# Altium schematic sheet 05_Seven_Seg.SchDoc: ECE315 Analog
size A; Date: 4/25/2017; ApprovedBy: JSK; CheckedBy: JSK; Author: JSK; CompanyName: University of Wisconsin; DrawnBy: JSK; Engineer: JSK; Organization: ECE 315; Address1: College of Engineering; Address2: 1415 Engineering Drive; Address3: Madison, WI 53706; Address4: ECE 315 Fall 2017; Revision: A; SheetNumber: 2; SheetTotal: 2; AssemblyNumber: ECE315-F19; ApprovedDate: 04/02/2019
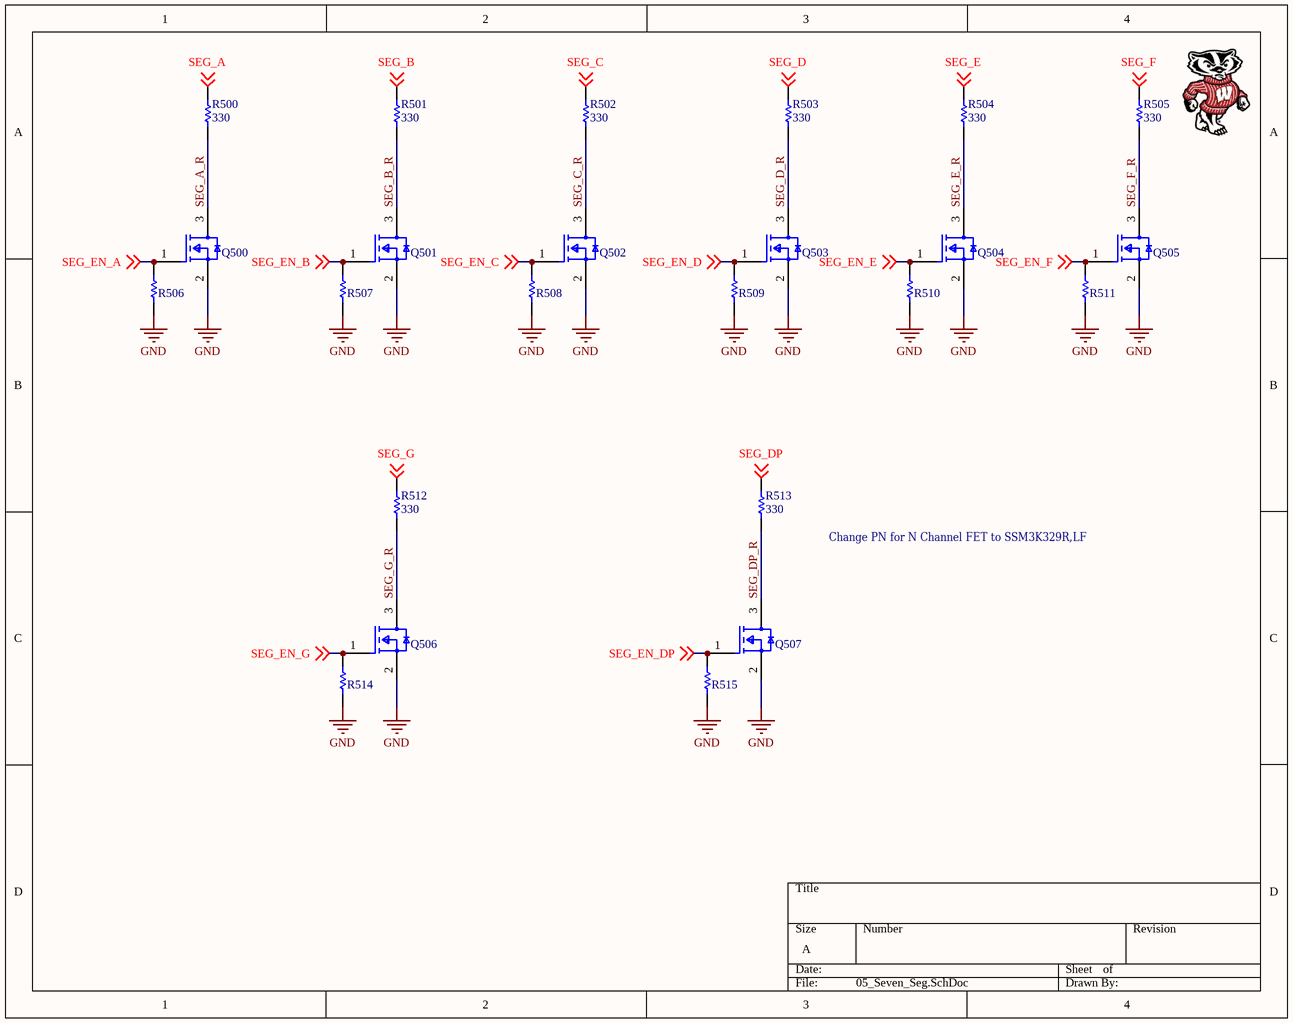
[diagram p0: 05_Seven_Seg.SchDoc]

## Parts
Q500  NDS7002A  [Diodes_Inc_SOT23_IPC_A]  (value not drawn)
Q501  NDS7002A  [Diodes_Inc_SOT23_IPC_A]  (value not drawn)
Q502  NDS7002A  [Diodes_Inc_SOT23_IPC_A]  (value not drawn)
Q503  NDS7002A  [Diodes_Inc_SOT23_IPC_A]  (value not drawn)
Q504  NDS7002A  [Diodes_Inc_SOT23_IPC_A]  (value not drawn)
Q505  NDS7002A  [Diodes_Inc_SOT23_IPC_A]  (value not drawn)
Q506  NDS7002A  [Diodes_Inc_SOT23_IPC_A]  (value not drawn)
Q507  NDS7002A  [Diodes_Inc_SOT23_IPC_A]  (value not drawn)
R500  330  [RES_0805]
R501  330  [RES_0805]
R502  330  [RES_0805]
R503  330  [RES_0805]
R504  330  [RES_0805]
R505  330  [RES_0805]
R506  RES_0805_K_010.00  [RES_0805]  (value not drawn)
R507  RES_0805_K_010.00  [RES_0805]  (value not drawn)
R508  RES_0805_K_010.00  [RES_0805]  (value not drawn)
R509  RES_0805_K_010.00  [RES_0805]  (value not drawn)
R510  RES_0805_K_010.00  [RES_0805]  (value not drawn)
R511  RES_0805_K_010.00  [RES_0805]  (value not drawn)
R512  330  [RES_0805]
R513  330  [RES_0805]
R514  RES_0805_K_010.00  [RES_0805]  (value not drawn)
R515  RES_0805_K_010.00  [RES_0805]  (value not drawn)

## Nets
GND: Q500.2(S) Q501.2(S) Q502.2(S) Q503.2(S) Q504.2(S) Q505.2(S) Q506.2(S) Q507.2(S) R506.1 R507.1 R508.1 R509.1 R510.1 R511.1 R514.1 R515.1
SEG_A: R500.2 ; off-sheet SEG_A
SEG_A_R: Q500.3(D) R500.1
SEG_B: R501.2 ; off-sheet SEG_B
SEG_B_R: Q501.3(D) R501.1
SEG_C: R502.2 ; off-sheet SEG_C
SEG_C_R: Q502.3(D) R502.1
SEG_D: R503.2 ; off-sheet SEG_D
SEG_D_R: Q503.3(D) R503.1
SEG_DP: R513.2 ; off-sheet SEG_DP
SEG_DP_R: Q507.3(D) R513.1
SEG_E: R504.2 ; off-sheet SEG_E
SEG_E_R: Q504.3(D) R504.1
SEG_EN_A: Q500.1(G) R506.2 ; off-sheet SEG_EN_A
SEG_EN_B: Q501.1(G) R507.2 ; off-sheet SEG_EN_B
SEG_EN_C: Q502.1(G) R508.2 ; off-sheet SEG_EN_C
SEG_EN_D: Q503.1(G) R509.2 ; off-sheet SEG_EN_D
SEG_EN_DP: Q507.1(G) R515.2 ; off-sheet SEG_EN_DP
SEG_EN_E: Q504.1(G) R510.2 ; off-sheet SEG_EN_E
SEG_EN_F: Q505.1(G) R511.2 ; off-sheet SEG_EN_F
SEG_EN_G: Q506.1(G) R514.2 ; off-sheet SEG_EN_G
SEG_F: R505.2 ; off-sheet SEG_F
SEG_F_R: Q505.3(D) R505.1
SEG_G: R512.2 ; off-sheet SEG_G
SEG_G_R: Q506.3(D) R512.1

## Notes on the sheet
- Change PN for N Channel FET to SSM3K329R,LF‎

## Library data of the parts
Q500-Q507 = NDS7002A: FAIRCHILD SEMICONDUCTOR         NDS7002A.            MOSFET, FULL REEL; Manufacturer 1: ON Semiconductor / Fairchild; Drain to Source Voltage (Vdss): 60V; Continuous Drain Current (ID): 280mA; Power Dissipation: 300mW; Drain to Source Resistance: 1.2R; Gate to Source Voltage (Vgs): 20V; Rds On Max: 2R; Input Capacitance: 50pF; Nominal Vgs: 2.1V; Number of Elements: 1; Element Configuration: Single; ComponentLink1URL: https://datasheet.ciiva.com/29746/dmn6140l-29746783.pdf?src-supplier=Digi-Key; ComponentLink1Description: https://datasheet.ciiva.com/29746/dmn6140l-29746783.pdf?src-supplier=Digi-Key; ComponentLink2URL: https://datasheet.ciiva.com/4444/ds30896-81375-4444887.pdf?src-supplier=Mouser; ComponentLink2Description: https://datasheet.ciiva.com/4444/ds30896-81375-4444887.pdf?src-supplier=Mouser; ComponentLink3URL: https://datasheet.ciiva.com/1254/ds30896-1254496.pdf?src-supplier=Newark; ComponentLink3Description: https://datasheet.ciiva.com/1254/ds30896-1254496.pdf?src-supplier=Newark; ComponentLink4URL: https://datasheet.ciiva.com/25624/0900766b81151e8c-25624936.pdf?src-supplier=RSComponents; ComponentLink4Description: https://datasheet.ciiva.com/25624/0900766b81151e8c-25624936.pdf?src-supplier=RSComponents; ComponentLink5URL: https://datasheet.ciiva.com/15137/getdatasheetpartid-75159-15137378.pdf?src-supplier=Verical; ComponentLink5Description: https://datasheet.ciiva.com/15137/getdatasheetpartid-75159-15137378.pdf?src-supplier=Verical; ComponentLink6URL: https://datasheet.ciiva.com/48532/ds30896-48532645.pdf?src-supplier=Avnet; ComponentLink6Description: https://datasheet.ciiva.com/48532/ds30896-48532645.pdf?src-supplier=Avnet; ComponentLink7URL: https://datasheet.ciiva.com/1188/ds30896-1188422.pdf?src-supplier=Element14; ComponentLink7Description: https://datasheet.ciiva.com/1188/ds30896-1188422.pdf?src-supplier=Element14; ComponentLink8URL: https://datasheet.ciiva.com/16200/ds30896-16200842.pdf?src-supplier=Future+Electronics; ComponentLink8Description: https://datasheet.ciiva.com/16200/ds30896-16200842.pdf?src-supplier=Future+Electronics; ComponentLink9URL: https://datasheet.ciiva.com/17323/ds30896-17323945.pdf?src-supplier=Avnet+Europe; ComponentLink9Description: https://datasheet.ciiva.com/17323/ds30896-17323945.pdf?src-supplier=Avnet+Europe; Supplier 1: Digi-Key; Supplier Part Number 1: NDS7002ACT-ND; Manufacturer Part Number 1: NDS7002A; RoHS: Yes; Category: MOSFETs; Stock 1: 640812; Pricing 1: 1=0.38000, 10=0.28600, 25=0.25040, 100=0.16190, 500=0.10724, 1000=0.08222 (USD); Mount: Surface Mount; Case/Package: SOT-23; Number of Pins: 3; Contact Plating: Tin,Matte; Min Operating Temperature: -65°C; Max Operating Temperature: 150°C; Packaging: Tape and Reel; Drain to Source Breakdown Voltage: 60V; Voltage Rating (DC): 60V; Current Rating: 280mA; Package Quantity: 1; Dual Supply Voltage: 60V; Max Power Dissipation: 300mW; Threshold Voltage: 2.1V; Voltage: 60V; On-State Resistance: 2R; Width: 3.05mm; Radiation Hardening: No; REACH SVHC: No SVHC; Lead Free: Lead Free; RoHS Compliant: Yes; ComponentLink10URL: https://datasheet.ciiva.com/15137/getdatasheetpartid-44394-15137140.pdf?src-supplier=Verical; ComponentLink10Description: https://datasheet.ciiva.com/15137/getdatasheetpartid-44394-15137140.pdf?src-supplier=Verical; ComponentLink11URL: https://datasheet.ciiva.com/34301/874832-34301640.pdf?src-supplier=Jameco; ComponentLink11Description: https://datasheet.ciiva.com/34301/874832-34301640.pdf?src-supplier=Jameco; ComponentLink12URL: https://datasheet.ciiva.com/931/nds7002a-931794.pdf?src-supplier=Digi-Key; ComponentLink12Description: https://datasheet.ciiva.com/931/nds7002a-931794.pdf?src-supplier=Digi-Key; ComponentLink13URL: https://datasheet.ciiva.com/931/nds7002a-931795.pdf?src-supplier=Digi-Key; ComponentLink13Description: https://datasheet.ciiva.com/931/nds7002a-931795.pdf?src-supplier=Digi-Key; ComponentLink14URL: https://datasheet.ciiva.com/931/nds7002a-931796.pdf?src-supplier=Digi-Key; ComponentLink14Description: https://datasheet.ciiva.com/931/nds7002a-931796.pdf?src-supplier=Digi-Key; ComponentLink15URL: https://datasheet.ciiva.com/4441/2n7002-8405-4441164.pdf?src-supplier=Mouser; ComponentLink15Description: https://datasheet.ciiva.com/4441/2n7002-8405-4441164.pdf?src-supplier=Mouser; ComponentLink16URL: https://datasheet.ciiva.com/46382/660093-46382951.pdf?src-supplier=Element14; ComponentLink16Description: https://datasheet.ciiva.com/46382/660093-46382951.pdf?src-supplier=Element14; ComponentLink17URL: https://datasheet.ciiva.com/16801/nds7002a-16801806.pdf?src-supplier=Future+Electronics; ComponentLink17Description: https://datasheet.ciiva.com/16801/nds7002a-16801806.pdf?src-supplier=Future+Electronics; ComponentLink18URL: https://datasheet.ciiva.com/22681/660093-22681829.pdf?src-supplier=Element14; ComponentLink18Description: https://datasheet.ciiva.com/22681/660093-22681829.pdf?src-supplier=Element14; ComponentLink19URL: https://datasheet.ciiva.com/22681/660093-22681830.pdf?src-supplier=Element14; ComponentLink19Description: https://datasheet.ciiva.com/22681/660093-22681830.pdf?src-supplier=Element14; ComponentLink20URL: https://datasheet.ciiva.com/28548/660093-28548223.pdf?src-supplier=Element14; ComponentLink20Description: https://datasheet.ciiva.com/28548/660093-28548223.pdf?src-supplier=Element14
R500-R505 R512 R513 = RES_0805_R_330.00: RES 330 OHM 1% 1/8W 0805; Manufacturer 1: Stackpole Electronics; Manufacturer Part Number 1: RMCF0805FT330R; Temperature Coefficient: 100ppm/°C; Resistance: 330R; Max Power Dissipation: 125mW; Features: Automotive AEC-Q200; Number of Terminations: 2; RoHS: Yes; Packaging: Tape and Reel; Tolerance: 1%; Category: Chip SMD Resistors; Supplier 1: Digi-Key; Supplier Part Number 1: RMCF0805FT330RCT-ND; Stock 1: 205996; Pricing 1: 1=0.10000, 10=0.02700, 100=0.01090, 1000=0.00488, 2500=0.00423 (USD); Mount: Surface Mount; Case/Package: 0805; Case Code (Metric): 2012; Case Code (Imperial): 0805; Contact Plating: Tin,Matte; Min Operating Temperature: -55°C; Max Operating Temperature: 155°C; Resistor Type: Thick Film; Series: RMCF; Construction: Rectangular; Length: 0.079inch; Width: 0.049inch; Height: 0.026inch; Depth: 1.25mm; Radiation Hardening: No; Military Standard: Not; Lead Free: Lead Free; RoHS Compliant: Yes; ComponentLink1URL: http://components.arrow.com/part/dataview/40963487S9848862N1174?src-supplier=Arrow+Electronics; ComponentLink1Description: http://components.arrow.com/part/dataview/40963487S9848862N1174?src-supplier=Arrow+Electronics; ComponentLink2URL: https://www.seielect.com/catalog/SEI-RMCF_RMCP.pdf?src-supplier=Avnet; ComponentLink2Description: https://www.seielect.com/catalog/SEI-RMCF_RMCP.pdf?src-supplier=Avnet; ComponentLink3URL: https://www.seielect.com/Catalog/SEI-RMCF_RMCP.pdf?src-supplier=Digi-Key; ComponentLink3Description: https://www.seielect.com/Catalog/SEI-RMCF_RMCP.pdf?src-supplier=Digi-Key; ComponentLink4URL: https://www.seielect.com/catalog/SEI-Packaging.pdf?src-supplier=Digi-Key; ComponentLink4Description: https://www.seielect.com/catalog/SEI-Packaging.pdf?src-supplier=Digi-Key; ComponentLink5URL: https://www.verical.com/server-webapp/html/getDatasheet?partID=559884&src-supplier=Verical; ComponentLink5Description: https://www.verical.com/server-webapp/html/getDatasheet?partID=559884&src-supplier=Verical
R506-R511 R514 R515 = RES_0805_K_010.00: RES SMD 10K OHM 1% 1/8W 0805; Manufacturer 1: Yageo; Manufacturer Part Number 1: RC0805FR-0710KL; Temperature Coefficient: 100ppm/°C; Power Rating: 125mW; Voltage Rating: 150V; Resistance: 10kR; Supplier 1: Digi-Key; Supplier Part Number 1: 311-10.0KCRCT-ND; Stock 1: 7562122; Pricing 1: 1=0.10000, 10=0.04200, 100=0.01690, 1000=0.00759, 2500=0.00659 (USD); RoHS: Yes; Case/Package: 0805; Case Code (Imperial): 0805; Case Code (Metric): 2012; Min Operating Temperature: -55°C; Max Operating Temperature: 155°C; Tolerance: 1%; Packaging: Tape and Reel; Features: Moisture Resistant; Termination: SMD/SMT; Number of Terminations: 2; Military Standard: Not; Max Power Dissipation: 125mW; Package Quantity: 1; Length: 2mm; Height: 0.024inch; Width: 0.049inch; Depth: 1.25mm; Lead Free: Lead Free; REACH SVHC: Unknown; ComponentLink1URL: https://datasheet.ciiva.com/11808/0900766b8106beab-11808151.pdf?src-supplier=RSComponents; ComponentLink1Description: https://datasheet.ciiva.com/11808/0900766b8106beab-11808151.pdf?src-supplier=RSComponents; ComponentLink2URL: https://datasheet.ciiva.com/12669/rc0805-12669688.pdf?src-supplier=Mouser; ComponentLink2Description: https://datasheet.ciiva.com/12669/rc0805-12669688.pdf?src-supplier=Mouser; ComponentLink3URL: https://datasheet.ciiva.com/46447/444164-46447563.pdf?src-supplier=Element14; ComponentLink3Description: https://datasheet.ciiva.com/46447/444164-46447563.pdf?src-supplier=Element14; ComponentLink4URL: https://datasheet.ciiva.com/2456/pyu-r-int-thick-7-2456972.pdf?src-supplier=Digi-Key; ComponentLink4Description: https://datasheet.ciiva.com/2456/pyu-r-int-thick-7-2456972.pdf?src-supplier=Digi-Key; ComponentLink5URL: https://datasheet.ciiva.com/2456/pyu-r-int-thick-7-2456973.pdf?src-supplier=Digi-Key; ComponentLink5Description: https://datasheet.ciiva.com/2456/pyu-r-int-thick-7-2456973.pdf?src-supplier=Digi-Key; ComponentLink6URL: https://datasheet.ciiva.com/2456/pyu-r-int-thick-7-2456974.pdf?src-supplier=Digi-Key; ComponentLink6Description: https://datasheet.ciiva.com/2456/pyu-r-int-thick-7-2456974.pdf?src-supplier=Digi-Key; ComponentLink7URL: https://datasheet.ciiva.com/16747/rc0805-16747087.pdf?src-supplier=Future+Electronics; ComponentLink7Description: https://datasheet.ciiva.com/16747/rc0805-16747087.pdf?src-supplier=Future+Electronics; Category: Chip SMD Resistors; Size Code: 0805; Resistor Type: Thick Film; Series: RC; Construction: Rectangular; Resistance Tolerance: 1%; Technology: THICK FILM; RoHS Compliant: Yes